# EAGLE design RF1 (EAGLE 6.4)
www.komby.com/RF1
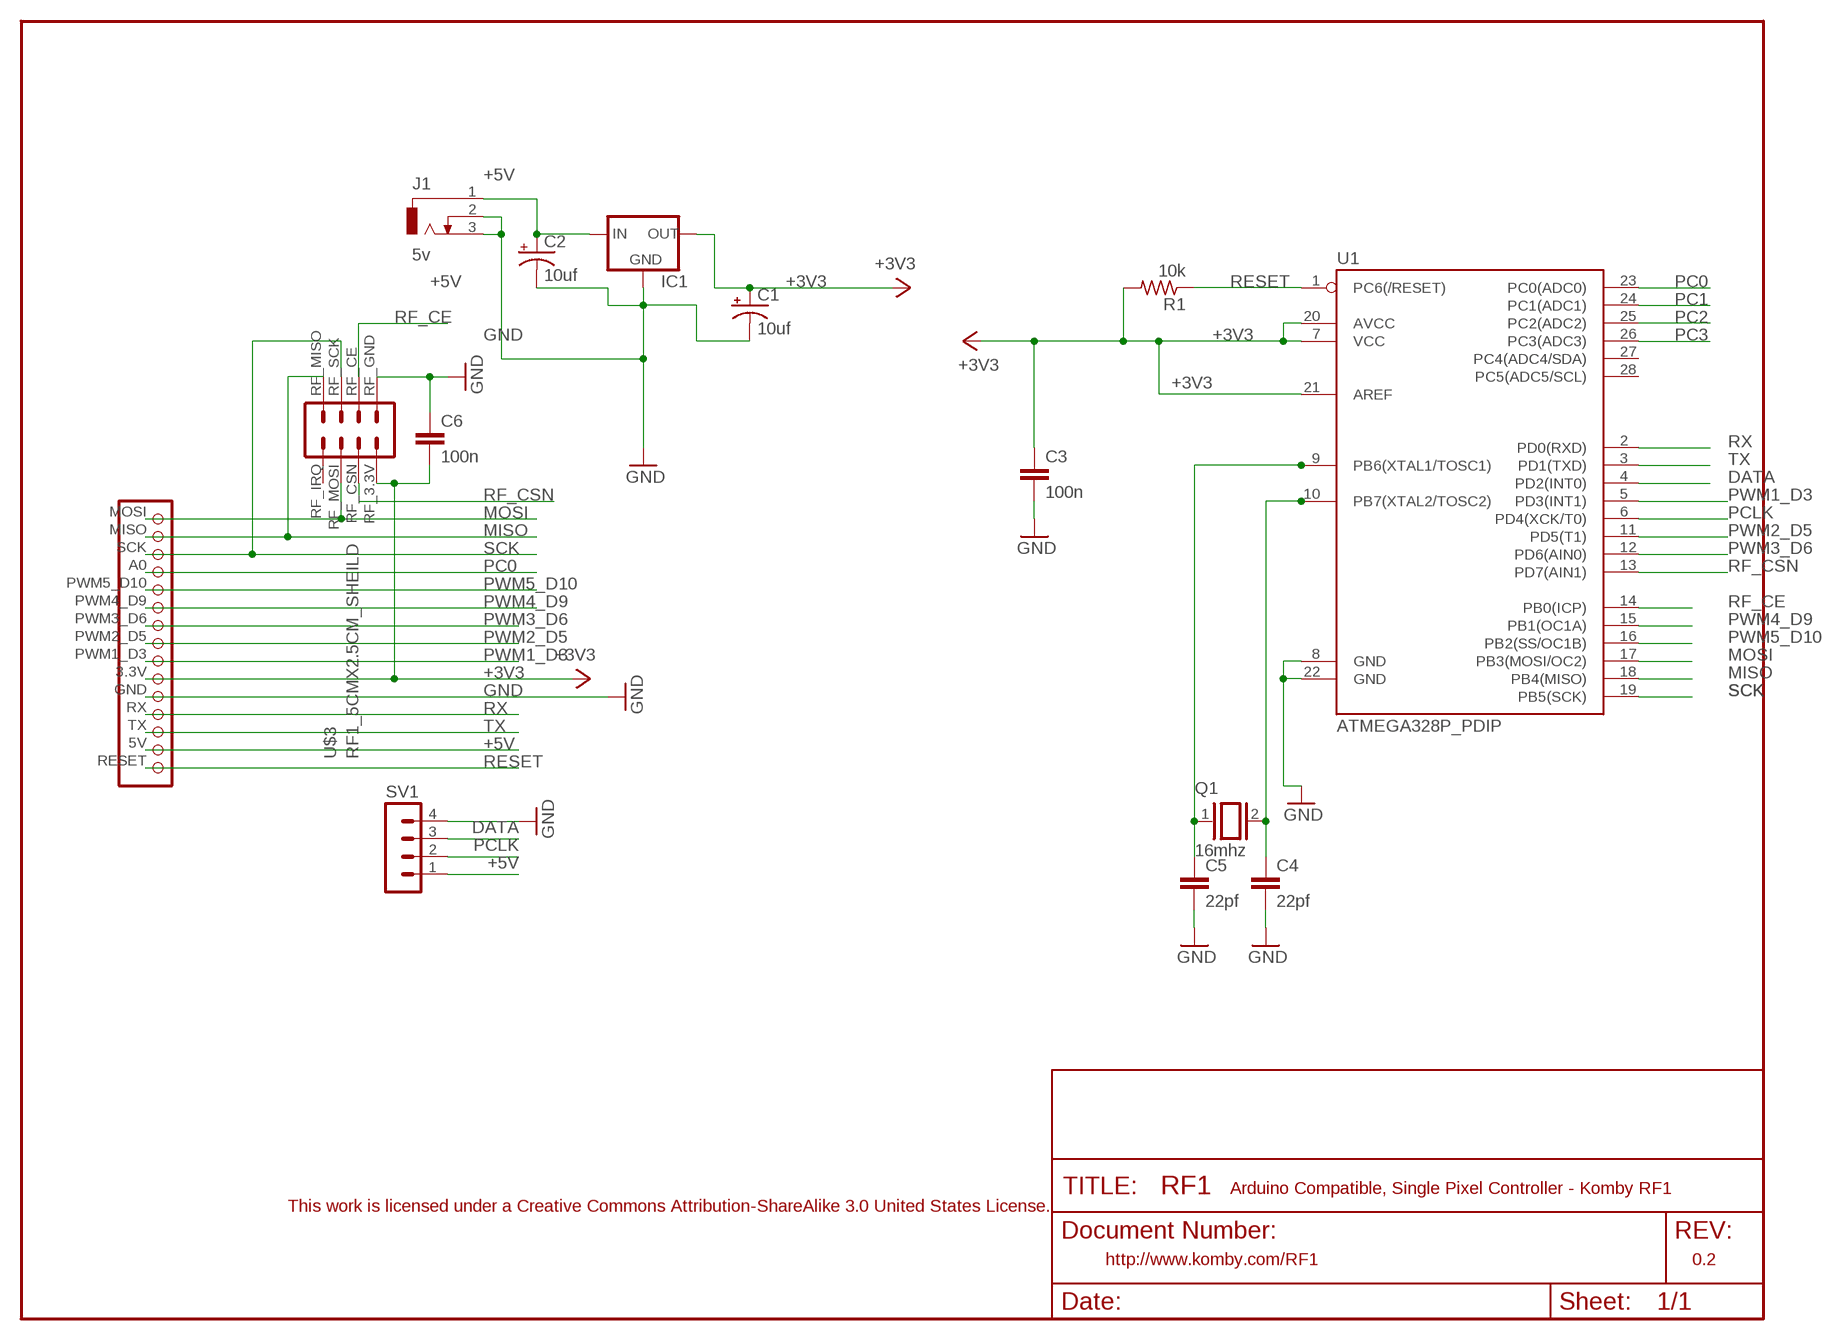
[diagram p0: schematic, sheet 1]

## Parts
C1  10uf  CPOL-USE1.8-4  [E1,8-4]
C2  10uf  CPOL-USE1.8-4  [E1,8-4]
C3  100n  C-EU025-024X044  [C025-024X044]
C4  22pf  C-EU025-024X044  [C025-024X044]
C5  22pf  C-EU025-024X044  [C025-024X044]
C6  100n  C-EU025-024X044  [C025-024X044]
IC1  MCP1700TRI  [TO92]
J1  5v  DCJ0303  [DCJ0303]
Q1  16mhz  XTAL/S  [QS]
R1  10k  R-US_0207/7  [0207/7]
SV1  MA04-1  [MA04-1]
U1  ATMEGA328P_PDIP  [DIL28-3]
U$3  RF1_5CMX2.5CM_SHEILD  [KOMBY_RF1_SHEILD_5X2.5]

## Nets
+3V3 [vcc]: C1.+ C3.1 C6.2 IC1.3(OUT) R1.2 U1.7(VCC) U1.20(AVCC) U1.21(AREF) U$3.3.3V U$3.RF_3.3V
+5V: C2.+ IC1.2(IN) J1.1 SV1.1 U$3.5V
DATA: SV1.3 U1.4(PD2(INT0))
GND [vcc]: C1.- C2.- C3.2 C4.2 C5.2 C6.1 IC1.1(GND) J1.2 J1.3 SV1.4 U1.8(GND) U1.22(GND) U$3.GND U$3.RF_GND(RFGND_1)
MISO: U1.18(PB4(MISO)) U$3.MISO U$3.RF_MISO
MOSI: U1.17(PB3(MOSI/OC2)) U$3.MOSI U$3.RF_MOSI
N$5: C4.1 Q1.2 U1.10(PB7(XTAL2/TOSC2))
N$6: C5.1 Q1.1 U1.9(PB6(XTAL1/TOSC1))
PC0: U1.23(PC0(ADC0)) U$3.A0(PC0)
PC1: U1.24(PC1(ADC1))
PC2: U1.25(PC2(ADC2))
PC3: U1.26(PC3(ADC3))
PCLK: SV1.2 U1.6(PD4(XCK/T0))
PWM1_D3: U1.5(PD3(INT1)) U$3.PWM1_D3(PWM1)
PWM2_D5: U1.11(PD5(T1)) U$3.PWM2_D5(PWM2)
PWM3_D6: U1.12(PD6(AIN0)) U$3.PWM3_D6(PWM3)
PWM4_D9: U1.15(PB1(OC1A)) U$3.PWM4_D9(PWM4)
PWM5_D10: U1.16(PB2(SS/OC1B)) U$3.PWM5_D10(PWM5)
RESET: R1.1 U1.1(PC6(/RESET)) U$3.RESET
RF_CE: U1.14(PB0(ICP)) U$3.RF_CE
RF_CSN: U1.13(PD7(AIN1)) U$3.RF_CSN
RX: U1.2(PD0(RXD)) U$3.RX
SCK: U1.19(PB5(SCK)) U$3.RF_SCK U$3.SCK
TX: U1.3(PD1(TXD)) U$3.TX
Unconnected: U1.27(PC4(ADC4/SDA)) U1.28(PC5(ADC5/SCL)) U$3.RF_IRQ

## Notes on the sheet
- Arduino Compatible, Single Pixel Controller - Komby RF1
- This work is licensed under a Creative Commons Attribution-ShareAlike 3.0 United States License.
- http://www.komby.com/RF1 | 0.2

## Library data of the parts
C1 C2 = adafruit:CPOL-US: POLARIZED CAPACITOR, American symbol
C3-C6 = resistor:C-EU: CAPACITOR, European symbol
IC1 = adafruit:MCP1700: VOLTAGE REGULATOR
J1 = con-jack:DCJ0303: DC POWER JACK Source: DCJ0303.pdf; OC_FARNELL: unknown; OC_NEWARK: unknown
Q1 = special:XTAL/S: CRYSTAL
R1 = adafruit:R-US_: RESISTOR, American symbol
SV1 = con-lstb:MA04-1: PIN HEADER; OC_FARNELL: unknown; OC_NEWARK: unknown
U1 = SparkFun-DigitalIC:ATMEGA328P_PDIP: uC used in the Arduino 32kb flash, 1k EEPROM, 2k SRAM This is the through-hole version of this chip.
U$3 = komby1:RF1_5CMX2.5CM_SHEILD

## Net classes
0 default: width 0.203 mm
1 vcc: width 0.305 mm
2 gnd: width 0.254 mm

## Board
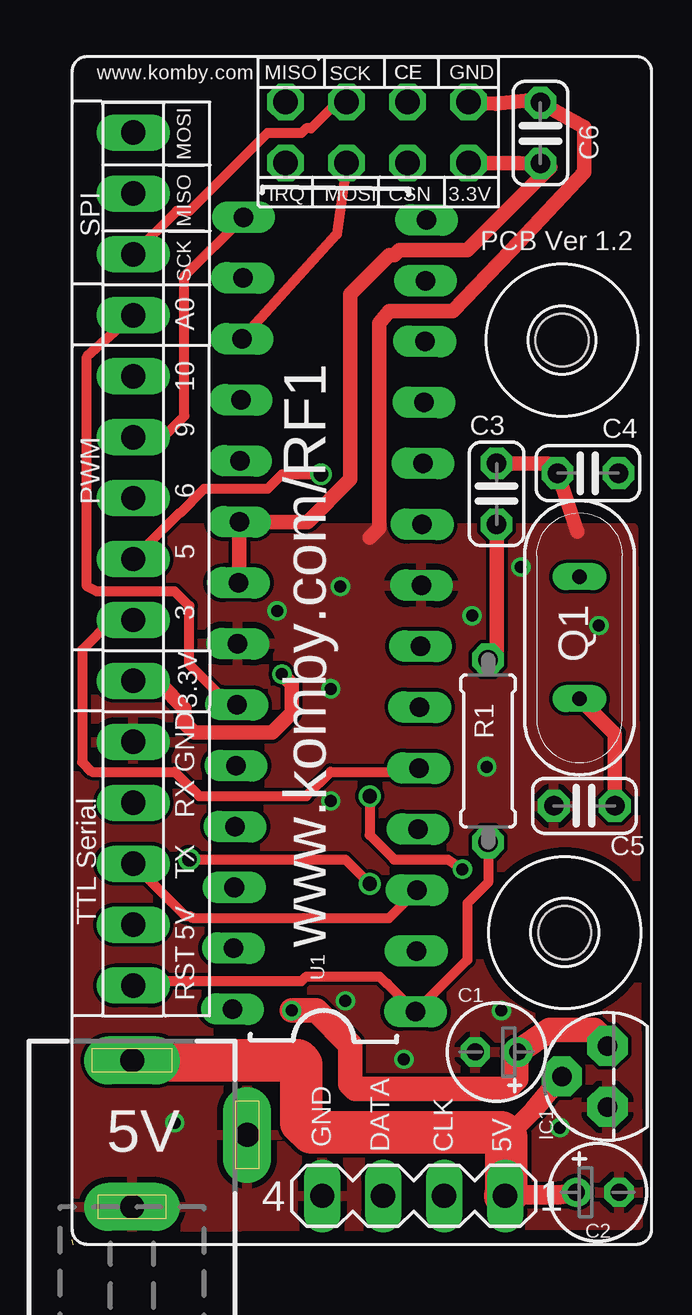
[diagram p1: board, top side]
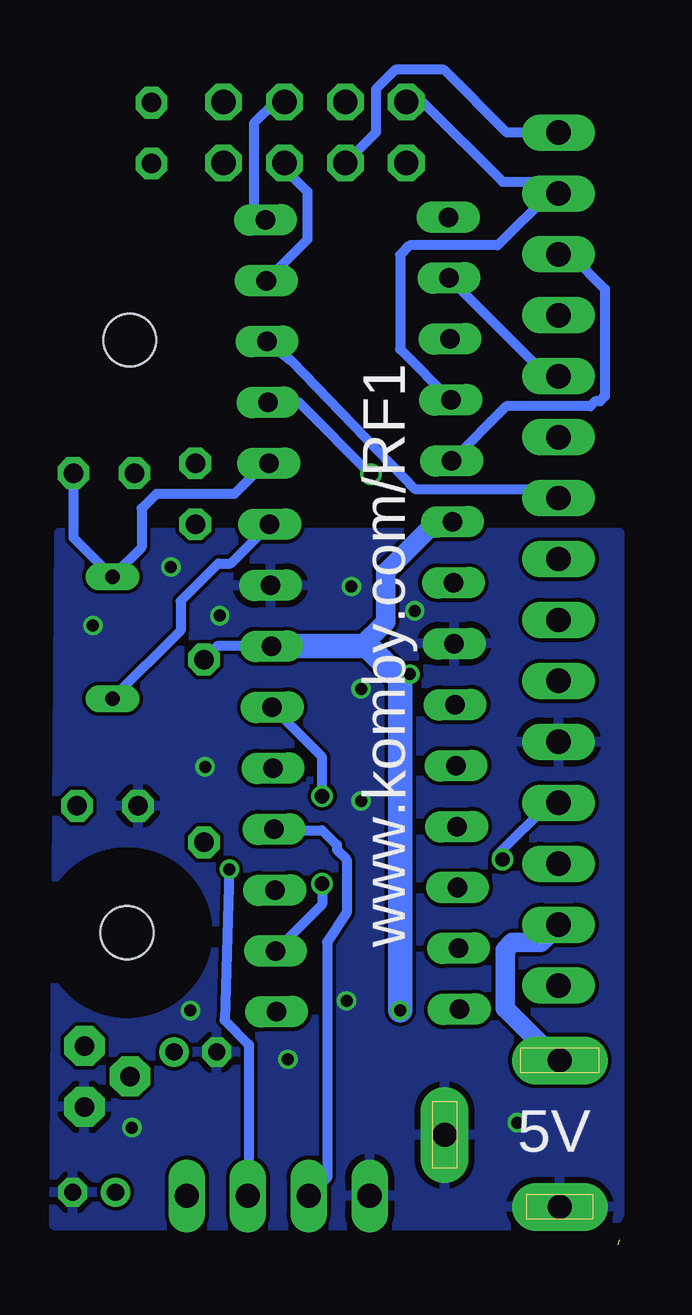
[diagram p2: board, bottom side, seen from below]

Size 0.05 x 0.2 mm. Coordinates in mm from the lower left corner, seen from the top.
Outline: 0.05,0 0,0.2
Copper layers (1*16): Top 0.035mm / dielectric 1.5mm / Bottom 0.035mm
Design rules "Fusion_eagle_rule_v1.1": minimum track width 6mil, minimum drill 12mil, track to track 6mil, track to pad 6mil, pad to pad 6mil, via to via 6mil, smd to smd 0mil, copper to edge 10mil, drill to drill 10mil, minimum pad ring 10mil, minimum via ring 6mil, stop-mask expansion 2mil, vias tented up to drill 100mil, thermal gap 10mil

### Footprints (pad centres in the part's own frame; a part is rotated, then mirrored left to right if it is on the bottom)
E1,8-4 = drill 0.711 pad 1.168: + -0.889,0 | drill 0.711 pad 1.168 octagon: - 0.889,0
C025-024X044 = drill 0.813 octagon: 1 -1.27,0; 2 1.27,0
TO92 = drill 0.813 pad 1.676 octagon: 1 -1.27,0; 2 0,1.905; 3 1.27,0
DCJ0303 = drill 1 pad 2 long: 1 0,3.1; 2 4.8,0; 3 0,-3
QS = drill 0.61 long: 1 -2.54,0; 2 2.54,0
0207/7 = drill 0.813 octagon: 1 -3.81,0; 2 3.81,0
MA04-1 = drill 1.016 long: 1 -3.81,0; 2 -1.27,0; 3 1.27,0; 4 3.81,0
DIL28-3 = drill 0.813 long: 1 -16.51,-3.81; 2 -13.97,-3.81; 3 -11.43,-3.81; 4 -8.89,-3.81; 5 -6.35,-3.81; 6 -3.81,-3.81; 7 -1.27,-3.81; 8 1.27,-3.81; 9 3.81,-3.81; 10 6.35,-3.81; 11 8.89,-3.81; 12 11.43,-3.81; 13 13.97,-3.81; 14 16.51,-3.81; 15 16.51,3.81; 16 13.97,3.81; 17 11.43,3.81; 18 8.89,3.81; 19 6.35,3.81; 20 3.81,3.81; 21 1.27,3.81; 22 -1.27,3.81; 23 -3.81,3.81; 24 -6.35,3.81; 25 -8.89,3.81; 26 -11.43,3.81; 27 -13.97,3.81; 28 -16.51,3.81
KOMBY_RF1_SHEILD_5X2.5 = drill 1.016 long: 3.3V 2.54,23.495; 5V 2.54,13.335; A0 2.54,38.735; GND 2.54,20.955; MISO 2.54,43.815; MOSI 2.54,46.355; PWM1_D3 2.54,26.035; PWM2_D5 2.54,28.575; PWM3_D6 2.54,31.115; PWM4_D9 2.54,33.655; PWM5_D10 2.54,36.195; RESET 2.54,10.795; RX 2.54,18.415; SCK 2.54,41.275; TX 2.54,15.875 | drill 1.016 octagon: RF_3.3V 16.51,45.085; RF_CE 13.97,47.625; RF_CSN 13.97,45.085; RF_GND 16.51,47.625; RF_IRQ 8.89,45.085; RF_MISO 8.89,47.625; RF_MOSI 11.43,45.085; RF_SCK 11.43,47.625 | hole 2.2: 20.406,37.703; 20.523,13.005

### Placement (x,y rotation side)
C1  17.68,8.03 180 top  (outside the outline)
C2  21.89,2.18 0 top  (outside the outline)
C3  17.68,31.29 90 top  (outside the outline)
C4  21.49,32.16 180 top  (outside the outline)
C5  21.34,18.29 180 top  (outside the outline)
C6  19.51,46.33 270 top  (outside the outline)
IC1  22.3,7.01 90 top  (outside the outline)
J1  2.49,4.57 0 top
Q1  21.13,25.3 90 top  (outside the outline)
R1  17.32,20.57 90 top  (outside the outline)
SV1  14.22,2.03 180 top  (outside the outline)
U1  10.72,26.26 89.2 top  (outside the outline)
U$3  0,0 0 top  (outside the outline)

### Tracks (layer width: path | path; a pad name or v marks a point on that pad's centre or on a via)
+3V3  (via drill 0.5)
  Top 0.61: v8.74,23.77 9.14,23.37 9.14,22.15 8.33,21.34 5.08,21.34 4.67,21.74 4.67,22.35 3.66,23.37 2.67,23.37 U$3.3.3V | C3.1 17.68,24.74 R1.2 | U1.21 6.96,27.62 U1.20 9.81,30.13 11.58,31.9 11.58,39.62 13.21,41.25 13.41,41.25 13.61,41.45 16.46,41.45 19.91,44.91 19.71,45.06 C6.2 18.62,45.09 U$3.RF_3.3V
  Top 1.016: IC1.3 22.2,8.48 21.74,8.94 19.89,8.94 C1.+ 18.49,7.54 18.49,6.91 18.09,6.5 11.79,6.5 11.58,6.71 11.58,8.33 10.16,9.75 v9.14,9.75
  Bottom 0.406: U1.7 16.77,24.94 R1.2
  Bottom 0.61: 8.94,21.34 9.14,21.54 | v8.74,23.77 8.94,23.77 9.14,23.57
  Bottom 0.813: U1.20 7.67,30.13 9.75,28.04 9.75,25.96 10.77,24.94
  Bottom 1.016: U1.7 10.77,24.94 10.51,24.94 9.14,23.57 9.14,21.54 v9.14,9.75
+5V
  Top 0.813: IC1.2 19.2,5.59 18.09,4.47 | 18.09,2.08 20.3,2.08 C2.+
  Top 1.778: J1.1 9.4,7.67 9.55,7.52 9.55,5.08 9.96,4.67 17.88,4.67 18.09,4.47 18.09,2.08 SV1.1
  Bottom 0.813: J1.1 2.59,7.67 4.78,9.86 4.78,12.29 4.47,12.6 3.28,12.6 U$3.5V
DATA
  Bottom 0.406: U1.4 14.36,17.27 12.39,17.27 11.79,16.66 11.79,16.46 11.38,16.05 11.38,13.82 12.19,12.6 12.19,2.79 SV1.3 13.01,1.98
GND  (via drill 0.5)
  Top 0.61: 21.03,29.72 C4.2 19.81,32.56 C3.2 | 12.39,29.46 12.8,29.87 12.8,38.41 13.21,38.91 15.85,38.91 18.29,41.45 21.34,44.7 21.34,46.58 C6.1 19.56,47.7 19.51,47.75 17.65,47.55 U$3.RF_GND
  other vias: 10.77,23.16 10.77,18.49 16.66,26.21 13.82,7.72 11.38,10.16 18.69,28.24 21.95,25.81 17.88,9.75 17.27,19.91 4.27,5.08 20.32,4.88 11.18,27.43 8.53,26.42
  pour Bottom: 23.57,0.81 1.07,0.81 arc-90 0,1.27 0,29.67 23.37,29.67
  pour Top: 23.57,0.81 1.57,0.71 arc-94 0.2,1.98 0.2,29.87 23.37,29.87
MISO
  Bottom 0.406: U$3.RF_MISO 8.2,47.62 4.88,44.3 3.02,44.3 U$3.MISO 2.92,43.81 5.08,41.66 8.74,41.66 9.14,41.25 9.14,37.32 U1.18
MOSI
  Top 0.406: U$3.RF_MOSI 11.02,42.11 U1.17
  Bottom 0.406: U$3.MOSI 4.7,46.35 7.32,48.97 9.35,48.97 10.16,48.16 10.16,46.35 U$3.RF_MOSI
N$5
  Bottom 0.406: C4.1 22.76,29.46 Q1.2 19.91,29.06 19.91,30.68 19.3,31.29 16.05,31.29 14.79,32.56 U1.10
N$6
  Top 0.61: C5.1 22.61,21.29 Q1.1
  Bottom 0.406: Q1.1 18.29,25.6 18.29,26.82 16.72,28.39 16.21,28.39 U1.9
PC0
  Top 0.406: U1.23 6.55,22.51 4.88,24.18 4.88,26.62 4.27,27.23 1.02,27.23 0.61,27.43 0.61,37.01 U$3.A0
PCLK  (via drill 0.5, 0.6)
  Top 0.406: v12.39,18.69 12.39,17.07 13.41,16.05 15.65,16.05 v16.26,15.65
  Bottom 0.406: v16.26,15.65 16.46,9.35 15.44,8.33 15.44,2.08 SV1.2 | v12.39,18.69 12.39,20.32 U1.6
PWM1_D3
  Top 0.406: U$3.PWM1_D3 1.65,26.04 0.41,24.79 0.41,20.12 0.81,19.71 4.27,19.71 5.28,18.69 9.75,18.69 10.77,19.71 14.29,19.71 U1.5
PWM2_D5  (via drill 0.6)
  Top 0.406: v10.36,32.11 8.74,32.11 8.13,31.5 5.49,31.5 4.47,30.48 4.45,30.48 U$3.PWM2_D5
  Bottom 0.406: U1.11 13.36,35.1 v10.36,32.11
PWM3_D6
  Bottom 0.406: U1.12 13.67,36.84 8.53,31.5 2.92,31.5 U$3.PWM3_D6
PWM4_D9
  Top 0.406: U$3.PWM4_D9 3.79,33.66 4.67,34.54 4.67,40.36 U1.15
PWM5_D10
  Bottom 0.406: U$3.PWM5_D10 3.01,36.2 U1.16
RESET
  Top 0.406: U$3.RESET 2.72,10.97 9.55,10.97 9.75,11.18 12.8,11.18 13.11,10.87 13.13,10.87 U1.1 16.46,11.86 16.46,14.22 17.32,15.09 R1.1
RF_CE
  Bottom 0.406: U$3.RF_CE 14.35,47.62 15.24,46.74 15.24,43.2 U1.14
RF_CSN
  Bottom 0.406: U$3.RF_CSN 13.97,44.86 13.01,43.89 13.01,41.9 U1.13
RX  (via drill 0.6)
  Top 0.406: v4.88,16.05 11.38,16.05 v12.39,15.04
  Bottom 0.406: U$3.RX 2.92,18.41 5.08,16.26 v4.88,16.05 | v12.39,15.04 12.39,14.18 U1.2
SCK
  Top 0.406: U$3.RF_SCK 11.05,47.62 9.96,46.53 9.75,46.53 9.55,46.33 8.13,46.33 4.88,43.08 4.34,43.08 U$3.SCK
  Bottom 0.406: U$3.SCK 2.06,41.27 0.61,39.83 0.61,35.36 0.81,35.15 1.02,35.15 1.22,34.95 4.71,34.95 U1.19
TX
  Top 0.406: U1.3 13.2,13.61 5.08,13.61 arc-45 4.91,13.69 4.73,13.69 U$3.TX

### Text on the board
tNames: www.komby.com | PCB Ver 1.2 | www.komby.com/RF1 | 5V | GND | DATA | CLK | 5V
bNames: www.komby.com/RF1 | 5V